# Altium project Milestone1.PrjPcb
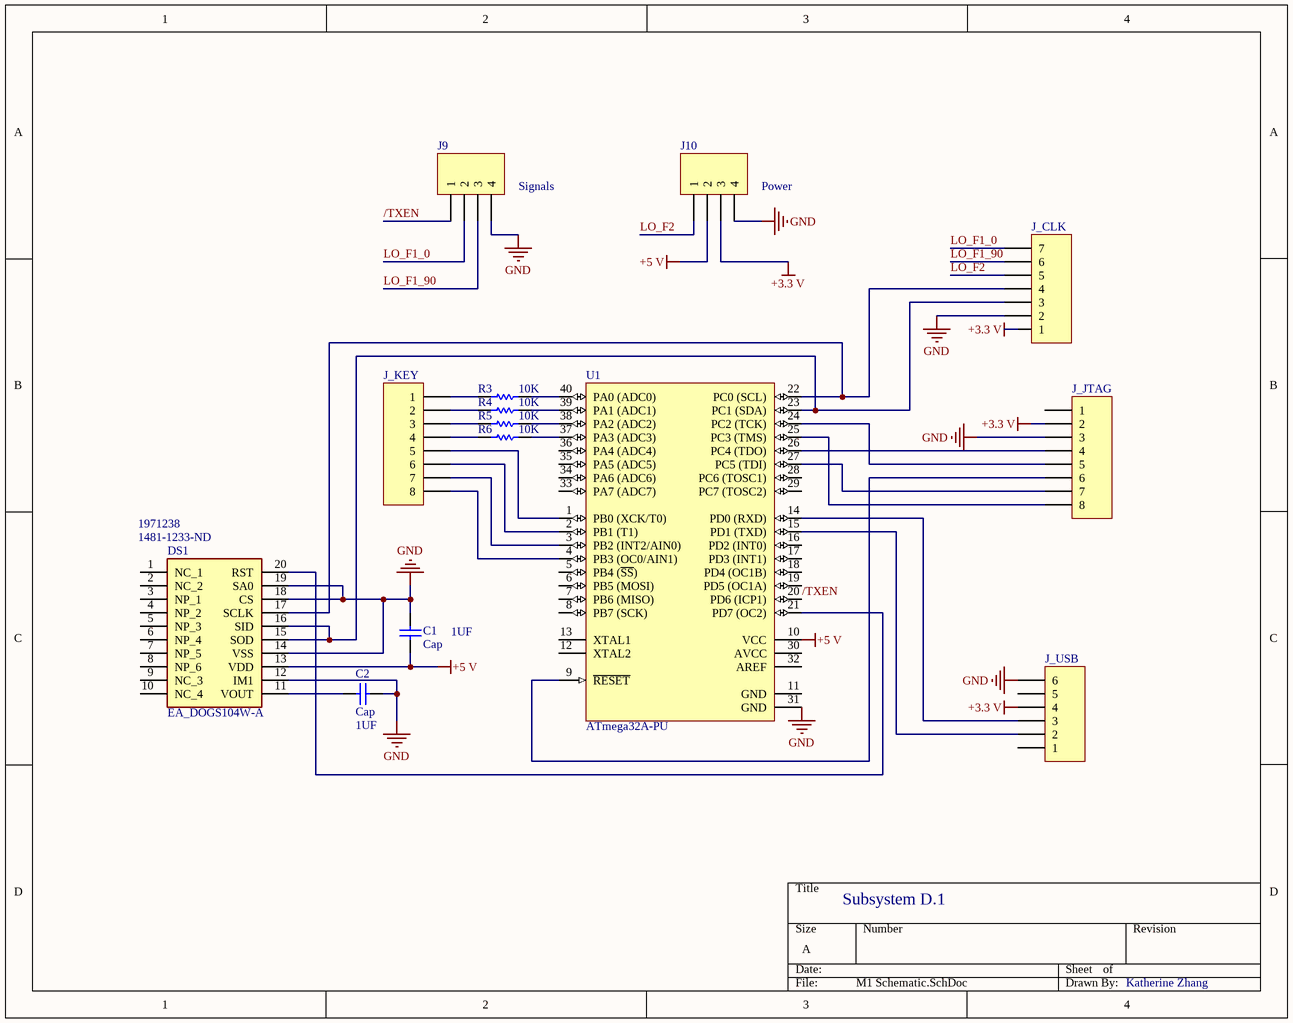
[diagram p0: M1 Schematic.SchDoc]
2 sheets, 22 parts. Net scope: global (net labels, ports and power ports of the same name join across sheets).
Board files: M2 PCB.PcbDoc, M2 PCB TX-RX.PcbDoc
Sheets:
  M1 Schematic.SchDoc
  M1 Schematic 2.SchDoc

## Sheet M1 Schematic.SchDoc: M1 Schematic
size A; Date: 2/22/2022; DrawnBy: Katherine Zhang; Revision: 1.0; SheetNumber: 1; SheetTotal: 2

### Parts
C1  Cap  value 1UF  [RADIAL-0.1]
C2  Cap  value 1UF  [RADIAL-0.1]
DS1  EA_DOGS104W-A  Supplier Part Number 1: 1481-1233-ND  Supplier Part Number 2: 1971238  [DIP2540W50P254L3600H260Q20N]
J9  Signals  [HDR1X4]
J10  Power  [HDR1X4]
J_CLK  Header 7  [HDR1X7]  (value not drawn)
J_JTAG  Header 8  [HDR1X8]  (value not drawn)
J_KEY  Header 8  [HDR1X8]  (value not drawn)
J_USB  Header 6  [HDR1X6]  (value not drawn)
R3  value 10K  [AXIAL-0.1-RES]  (hidden comment: Res1)
R4  value 10K  [AXIAL-0.1-RES]  (hidden comment: Res1)
R5  value 10K  [AXIAL-0.1-RES]  (hidden comment: Res1)
R6  value 10K  [AXIAL-0.1-RES]  (hidden comment: Res1)
U1  ATmega32A-PU  [40P6]

### Nets
+3.3 V: J10.3 J_CLK.1 J_JTAG.2 J_USB.4
+5 V: C1.1 DS1.13(VDD) J10.2 U1.10(VCC)
GND: C1.2 C2.2 DS1.12(IM1) DS1.14(VSS) DS1.18(CS) DS1.19(SA0) J9.4 J10.4 J_CLK.2 J_JTAG.3 J_USB.6 U1.31(GND)
/TXEN: J9.1 U1.20(PD6_(ICP1))
LO_F1_0: J9.2 J_CLK.7
LO_F1_90: J9.3 J_CLK.6
LO_F2: J10.1 J_CLK.5
NetC2_1: C2.1 DS1.11(VOUT)
NetDS1_15: DS1.15(SOD) DS1.16(SID) J_CLK.3 U1.23(PC1_(SDA))
NetDS1_17: DS1.17(SCLK) J_CLK.4 U1.22(PC0_(SCL))
NetDS1_20: DS1.20(RST) U1.21(PD7_(OC2))
NetJ_JTAG_4: J_JTAG.4 U1.26(PC4_(TDO))
NetJ_JTAG_5: J_JTAG.5 U1.24(PC2_(TCK))
NetJ_JTAG_6: J_JTAG.6 U1.9(~{RESET})
NetJ_JTAG_7: J_JTAG.7 U1.27(PC5_(TDI))
NetJ_JTAG_8: J_JTAG.8 U1.25(PC3_(TMS))
NetJ_KEY_1: J_KEY.1 R3.1
NetJ_KEY_2: J_KEY.2 R4.1
NetJ_KEY_3: J_KEY.3 R5.1
NetJ_KEY_4: J_KEY.4 R6.1
NetJ_KEY_5: J_KEY.5 U1.1(PB0_(XCK/T0))
NetJ_KEY_6: J_KEY.6 U1.2(PB1_(T1))
NetJ_KEY_7: J_KEY.7 U1.3(PB2_(INT2/AIN0))
NetJ_KEY_8: J_KEY.8 U1.4(PB3_(OC0/AIN1))
NetJ_USB_2: J_USB.2 U1.15(PD1_(TXD))
NetJ_USB_3: J_USB.3 U1.14(PD0_(RXD))
NetR3_2: R3.2 U1.40(PA0_(ADC0))
NetR4_2: R4.2 U1.39(PA1_(ADC1))
NetR5_2: R5.2 U1.38(PA2_(ADC2))
NetR6_2: R6.2 U1.37(PA3_(ADC3))

Not connected (* = marked no-connect by the designer): DS1 1(NC_1) 2(NC_2) 3(NP_1) 4(NP_2) 5(NP_3) 6(NP_4) 7(NP_5) 8(NP_6) 9(NC_3) 10(NC_4); J_JTAG 1; J_USB 1 5; U1 5(PB4_(~{SS})) 6(PB5_(MOSI)) 7(PB6_(MISO)) 8(PB7_(SCK)) 11(GND) 12(XTAL2) 13(XTAL1) 16(PD2_(INT0)) 17(PD3_(INT1)) 18(PD4_(OC1B)) 19(PD5_(OC1A)) 28(PC6_(TOSC1)) 29(PC7_(TOSC2)) 30(AVCC) 32(AREF) 33(PA7_(ADC7)) 34(PA6_(ADC6)) 35(PA5_(ADC5)) 36(PA4_(ADC4))

### Notes on the sheet
- Subsystem D.1
- Katherine Zhang

### Library data of the parts
C1 C2 = CAP ALUM 1UF 20% 100V RADIAL: Capacitor; Manufacturer Part Number: ESE105M100AC3EA; Designator: C?; Voltage Rating: 100V; Published: 8-Jun-2000; LatestRevisionDate: 17-Jul-2002; LatestRevisionNote: Re-released for DXP Platform.; Publisher: Altium Limited
DS1 = EA_DOGS104W-A: LCM char. 4x10 FSTN White; Manufacturer_Name: ELECTRONIC ASSEMBLY; Manufacturer_Part_Number: EA DOGS104W-A; Manufacturer: Display Visions; Manufacturer Part Number: EADOGS104W-A; Interface: I2C,SPI; Number of Characters: 40; Backlight Type: LED; Datasheet Link: https://componentsearchengine.com//EA DOGS104W-A.pdf; Height: 2.6mm; Mouser2 Part Number: 790-EADOGS104W-A; Mouser2 Price/Stock: https://www.mouser.com/Search/Refine.aspx?Keyword=790-EADOGS104W-A; Supplier 1: Digi-Key; RoHS: No; Stock 1: 221; Pricing 1: 1=18.94000, 10=14.28400, 100=11.99810, 500=11.55000 (USD); Min Operating Temperature: -20°C; Max Operating Temperature: 70°C; Background Color: White; ComponentLink1URL: http://www.lcd-module.de/fileadmin/html-seiten/eng/pdf/doma/dogs104e.pdf?src-supplier=Digi-Key; ComponentLink1Description: http://www.lcd-module.de/fileadmin/html-seiten/eng/pdf/doma/dogs104e.pdf?src-supplier=Digi-Key; Supplier 2: RSComponents; Stock 2: 5; Pricing 2: 1=15.55000, 5=14.06000, 10=13.29000, 25=12.60000 (GBP); ComponentLink2URL: http://www.mouser.com/ds/2/127/dogs104e-553061.pdf?src-supplier=Mouser; ComponentLink2Description: http://www.mouser.com/ds/2/127/dogs104e-553061.pdf?src-supplier=Mouser
J9 J10 = Header 4: Conn Header Vert 4POS 2.54MM; Manufacturer: Sullins; Manufacturer Part Number: PRPC004SAAN-RC; Number of Positions: 4; Connector Type: Male Pin; Pitch: 0.1inch; LatestRevisionDate: 17-Jul-2002; LatestRevisionNote: Re-released for DXP Platform.; Publisher: Altium Limited; Supplier 1: Digi-Key; Supplier Part Number 1: S1011EC-04-ND; RoHS: Yes; Category: Connectors; Stock 1: 11461; Pricing 1: 1=0.15000, 10=0.14600, 25=0.10840, 50=0.09280, 100=0.08980, 250=0.07740, 500=0.07430 (USD); Mount: Through Hole; Color: Black; Contact Plating: Gold; Package Quantity: 1; Number of Rows: 1; Packaging: Bulk; Termination: Solder; Series: -; Contact Type: Male Pin; Contact Mating Length: 0.23inch; RoHS Compliant: Yes; ComponentLink1URL: https://datasheet.ciiva.com/741/xrxczzzsxxn-rc-st-11635-b-741241.pdf?src-supplier=Digi-Key; ComponentLink1Description: https://datasheet.ciiva.com/741/xrxczzzsxxn-rc-st-11635-b-741241.pdf?src-supplier=Digi-Key
J_CLK = Header 7: Female, 7C, Straight, .100"CC; 3.20mm Tail, No Mt. 100u" Tin; PBT, Phos Bronze, 105 C; Manufacturer: Sullins; Manufacturer Part Number: PPTC071LFBN-RC; Number of Positions: 7; Pitch: 0.1inch; LatestRevisionDate: 17-Jul-2002; LatestRevisionNote: Re-released for DXP Platform.; Publisher: Altium Limited; Supplier 1: Digi-Key; Supplier Part Number 1: S7005-ND; RoHS: Yes; Category: Connectors; Stock 1: 25873; Pricing 1: 1=0.59000, 10=0.51500, 80=0.42438, 440=0.36900, 1000=0.30442, 5000=0.26752, 10000=0.26650 (USD); Mount: Through Hole; Color: Black; Contact Plating: Tin; Contact Material: Bronze; Housing Material: Plastic; Package Quantity: 1000; Number of Rows: 1; Packaging: Bulk; Termination: Solder; Connector Type: Header; Contact Type: Female Socket; Length: 18.3mm; Width: 2.5mm; Height: 8.5mm; Lead Free: Lead Free; ComponentLink1URL: https://media.digikey.com/pdf/Data%20Sheets/Sullins%20PDFs/Female_Headers.100_DS.pdf?src-supplier=Digi-Key; ComponentLink1Description: https://media.digikey.com/pdf/Data%20Sheets/Sullins%20PDFs/Female_Headers.100_DS.pdf?src-supplier=Digi-Key; ComponentLink2URL: http://www.sullinscorp.com/catalogs/78_Page80-81_HEADER_.100_2.54mm_FEMALE.pdf?src-supplier=Future+Electronics; ComponentLink2Description: http://www.sullinscorp.com/catalogs/78_Page80-81_HEADER_.100_2.54mm_FEMALE.pdf?src-supplier=Future+Electronics
J_JTAG J_KEY = Header 8: Conn Header Vert 8POS 2.54MM; Manufacturer: Sullins; Manufacturer Part Number: PRPC008SAAN-RC; Number of Positions: 8; Connector Type: Male Pin; Pitch: 0.1inch; LatestRevisionDate: 17-Jul-2002; LatestRevisionNote: Re-released for DXP Platform.; Publisher: Altium Limited; Supplier 1: Digi-Key; Supplier Part Number 1: S1011EC-08-ND; RoHS: Yes; Category: Connectors; Stock 1: 4930; Pricing 1: 1=0.25000, 10=0.23200, 25=0.19800, 50=0.17340, 100=0.16100, 250=0.14240, 500=0.13622 (USD); Mount: Through Hole; Color: Black; Contact Plating: Gold; Package Quantity: 1; Number of Rows: 1; Packaging: Bulk; Termination: Solder; Series: -; Contact Type: Male Pin; Contact Mating Length: 0.23inch; Lead Free: Lead Free; RoHS Compliant: Yes; ComponentLink1URL: https://datasheet.ciiva.com/741/xrxczzzsxxn-rc-st-11635-b-741237.pdf?src-supplier=Digi-Key; ComponentLink1Description: https://datasheet.ciiva.com/741/xrxczzzsxxn-rc-st-11635-b-741237.pdf?src-supplier=Digi-Key
J_USB = Header 6: Conn Header .100" Sngl Str 6POS; Manufacturer: Sullins; Manufacturer Part Number: PRPC006SAAN-RC; Number of Positions: 6; Connector Type: Male Pin; Pitch: 0.1inch; LatestRevisionDate: 17-Jul-2002; LatestRevisionNote: Re-released for DXP Platform.; Publisher: Altium Limited; Supplier 1: Digi-Key; Supplier Part Number 1: S1011EC-06-ND; RoHS: Yes; Category: Connectors; Stock 1: 13258; Pricing 1: 1=0.19000, 10=0.17400, 25=0.14880, 50=0.13000, 100=0.12070, 250=0.10680, 500=0.10216 (USD); Mount: Through Hole; Color: Black; Contact Plating: Gold; Package Quantity: 1; Number of Rows: 1; Packaging: Bulk; Termination: Solder; Series: -; Contact Type: Male Pin; Contact Mating Length: 0.23inch; Lead Free: Lead Free; RoHS Compliant: Yes; ComponentLink1URL: https://datasheet.ciiva.com/741/xrxczzzsxxn-rc-st-11635-b-741239.pdf?src-supplier=Digi-Key; ComponentLink1Description: https://datasheet.ciiva.com/741/xrxczzzsxxn-rc-st-11635-b-741239.pdf?src-supplier=Digi-Key
R3-R6 = RES 10K OHM 5% 1/4W AXIAL: Resistor; Manufacturer Part Number: CFR-25JB-52-10K; Designator: R?; Power Rating: 1/4W; Tolerance: 0.05; Published: 8-Jun-2000; LatestRevisionDate: 17-Jul-2002; LatestRevisionNote: Re-released for DXP Platform.; Publisher: Altium Limited
U1 = CMP-0095-00028-2: 8-bit AVR Microcontroller, 2.7-5.5V, 16MHz, 32KB Flash, 1KB EEPROM, 2KB SRAM, 40-pin PDIP, Industrial Grade (-40°C to 85°C); Manufacturer: Microchip; Manufacturer Part Number: ATMEGA324A-PU; Interface: I2C,SPI,UART,USART; Peripherals: Brown-out Detect/Reset,POR,PWM,WDT; Frequency: 20MHz; Number of I/Os: 32; Oscillator Type: Internal; Code_JEDEC: MS-011-AC; ComponentLink3Description: ATmega32A Summary; PackageVersion: revB, Sep-2001; ComponentLink2Description: ATmega32A Datasheet; ComponentLink3URL: http://www.atmel.com/dyn/resources/prod_documents/8155S.pdf; PackageDescription: 40-lead (0.600"/15.24mm Wide) Plastic Dual Inline Package (PDIP); ComponentLink1Description: Manufacturer URL; PackageReference: 40P6; DatasheetVersion: revC, Feb-2011; ComponentLink2URL: http://www.atmel.com/dyn/resources/prod_documents/doc8155.pdf; RevisionNote: DatasheetVersion updated. URLs added.; ComponentLink1URL: http://www.atmel.com/; Supplier 1: Digi-Key; Supplier Part Number 1: ATMEGA324A-PU-ND; RoHS: Yes; Category: Microcontrollers; Stock 1: 315; Pricing 1: 1=4.77000, 25=4.38160, 100=3.97500 (USD); Case/Package: DIP; Min Operating Temperature: -40°C; Max Operating Temperature: 85°C; Core Architecture: AVR; Memory Type: FLASH; Packaging: Rail/Tube; Memory Size: 32KB; RoHS Compliant: Yes; ComponentLink4URL: http://ww1.microchip.com/downloads/en/devicedoc/Atmel-8272-8-bit-AVR-microcontroller-ATmega164A_PA-324A_PA-644A_PA-1284_P_summary.pdf?src-supplier=Digi-Key; ComponentLink4Description: http://ww1.microchip.com/downloads/en/devicedoc/Atmel-8272-8-bit-AVR-microcontroller-ATmega164A_PA-324A_PA-644A_PA-1284_P_summary.pdf?src-supplier=Digi-Key

## Sheet M1 Schematic 2.SchDoc: TX/RX Switch
size A; Date: Feb 27 2022; DrawnBy: Katherine Zhang; SheetNumber: 2; SheetTotal: 2
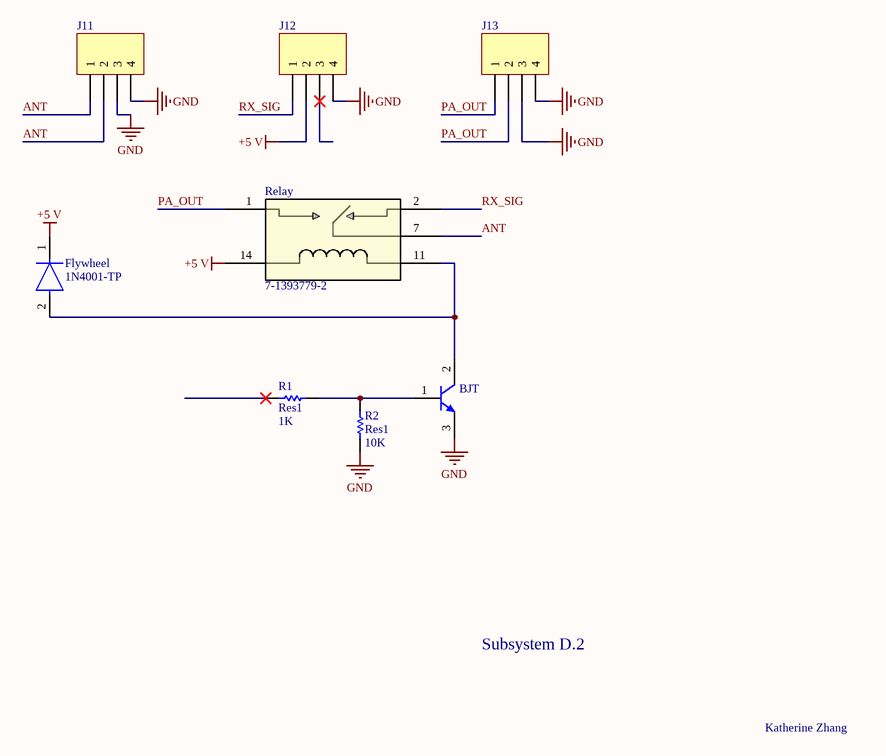
[diagram p1: M1 Schematic 2.SchDoc]

### Parts
BJT  2N2222A  [STM-TO-18-3]  (value not drawn)
Flywheel  1N4001-TP  [FP-DO-41-MFG]
J11  Header 4  [HDR1X4]  (value not drawn)
J12  Header 4  [HDR1X4]  (value not drawn)
J13  Header 4  [HDR1X4]  (value not drawn)
R1  Res1  value 1K  [AXIAL-0.1-RES]
R2  Res1  value 10K  [AXIAL-0.1-RES]
Relay  7-1393779-2  [RELAY_7-1393779-2]

### Nets
+5 V: Flywheel.1(C) J12.2 Relay.14
GND: BJT.3(E) J11.3 J11.4 J12.4 J13.3 J13.4 R2.1
ANT: J11.1 J11.2 Relay.7
PA_OUT: J13.1 J13.2 Relay.1
RX_SIG: J12.1 Relay.2
NetBJT_1: BJT.1(B) R1.2 R2.2
NetBJT_2: BJT.2(C) Flywheel.2(A) Relay.11

Not connected (* = marked no-connect by the designer): J12 3*; R1 1*

### Notes on the sheet
- Subsystem D.2
- Katherine Zhang

### Library data of the parts
BJT = CMP-2000-05381-1: High Speed Switch, 0.6 A IC, -65 to 175 degC, 3-Pin TO-18, RoHS, Bulk; Manufacturer: STMicroelectronics; Power Dissipation Pd: 500mW; DC Current Gain hFE: 300hFE; Transistor Polarity: NPN; DC Collector Current: 600mA; No. of Pins: 3Pins; Transition Frequency ft: 300MHz; Collector Emitter Voltage V(br)ceo: 40V; hFE Min: 40; Max Power Dissipation: 400mW; Number of Elements: 1; Collector Base Voltage (VCBO): 75V; Emitter Base Voltage (VEBO): 6V; Collector Emitter Saturation Voltage: 1V; Element Configuration: Single; Product Range: -; Package Reference: TO-18-3; Datasheet URL: https://datasheet.ciiva.com/25917/cd00003223-25917094.pdf; Automotive Qualification Standard: -; Transistor Case Style: TO-18; Operating Temperature Max: 175degC; Datasheet Version: Feb-03; Package Description: 3-Pin Through Hole Device, Dia 5.8 mm, Pitch 1.27 mm; Manufacturer URL: http://www.st.com/; Supplier 1: Digi-Key; Supplier Part Number 1: 497-2598-ND; Manufacturer Part Number: 2N2222A; RoHS: Yes; Category: BJTs; Mount: Through Hole; Case/Package: TO-18-3; Number of Pins: 3; Weight: 0.012346oz; Min Operating Temperature: -65°C; Max Operating Temperature: 175°C; Frequency: 300MHz; Packaging: Bulk; Package Quantity: 1000; Collector Emitter Voltage (VCEO): 40V; Polarity: NPN; Max Collector Current: 600mA; Collector Emitter Breakdown Voltage: 40V; Transition Frequency: 300MHz; Power Dissipation: 500mW; Max Frequency: 300MHz; Gain Bandwidth Product: 300MHz; Voltage Rating (DC): 75V; Current Rating: 600mA; Type: Switch; Collector-emitter Voltage-Max: 40V; Series: 2N2222; Continuous Collector Current: 600mA; Length: 5.8mm; Width: 5.8mm; Height: 1.5mm; Radiation Hardening: No; REACH SVHC: No SVHC; Lead Free: Contains Lead; RoHS Compliant: Yes; ComponentLink1URL: https://datasheet.ciiva.com/25917/cd00003223-25917094.pdf?src-supplier=Avnet+Europe; ComponentLink1Description: https://datasheet.ciiva.com/25917/cd00003223-25917094.pdf?src-supplier=Avnet+Europe; ComponentLink2URL: https://datasheet.ciiva.com/15192/getdatasheetpartid-292165-15192875.pdf?src-supplier=Verical; ComponentLink2Description: https://datasheet.ciiva.com/15192/getdatasheetpartid-292165-15192875.pdf?src-supplier=Verical; ComponentLink3URL: https://datasheet.ciiva.com/14166/2n2222a-eng-tds-14166093.pdf?src-supplier=Distrelec; ComponentLink3Description: https://datasheet.ciiva.com/14166/2n2222a-eng-tds-14166093.pdf?src-supplier=Distrelec; ComponentLink4URL: https://datasheet.ciiva.com/16427/cd00003223-16427384.pdf?src-supplier=Future+Electronics; ComponentLink4Description: https://datasheet.ciiva.com/16427/cd00003223-16427384.pdf?src-supplier=Future+Electronics; ComponentLink5URL: https://datasheet.ciiva.com/977/cd00003223-977271.pdf?src-supplier=Digi-Key; ComponentLink5Description: https://datasheet.ciiva.com/977/cd00003223-977271.pdf?src-supplier=Digi-Key; ComponentLink6URL: https://datasheet.ciiva.com/1194/1449532-1194083.pdf?src-supplier=Element14; ComponentLink6Description: https://datasheet.ciiva.com/1194/1449532-1194083.pdf?src-supplier=Element14; ComponentLink7URL: https://datasheet.ciiva.com/29323/163147-da-01-en-transistor-2-n-2222-a-to18-stm-29323030.pdf?src-supplier=Conrad; ComponentLink7Description: https://datasheet.ciiva.com/29323/163147-da-01-en-transistor-2-n-2222-a-to18-stm-29323030.pdf?src-supplier=Conrad
Flywheel = CMP-56207-000001-1: DIODE GEN PURP 50V 1A DO41; Manufacturer: Micro Commercial; Max Surge Forward Current: 30A; Max Junction Temp: +150°C; Capacitance: 15pF; Peak Reverse Current: 5uA; Value: 15pF; Forward Voltage: 1.1V; Recovery Time: 2000ns; Reverse Recovery Time: 2us; Element Configuration: Single; Polarity: Standard; Manufacturer Part Number: 1N4001-TP; Height: 2.7mm; Device Class L3: Rectifier Diodes; Octopart: https://octopart.com/1n4001-tp-mcc-730241; ComponentLink2URL: http://www.mccsemi.com/up_pdf/1N4001-1N4007(DO-41).pdf; ComponentLink2Description: Datasheet; Reverse Voltage: 50V; Lead Free: Yes; Temperature: -55°C to +150°C; Forward Current: 1A; RoHS: TRUE; Temperature Range Low: -55°C; Package: DO-41; Category: Diode; Temperature Range High: +150°C; Digikey Description: DIODE GEN PURP 50V 1A DO41; Ipc Land Pattern Name: DIOPA1114W105L520D270; Mouser Description: Rectifiers Vr/50V Io/1A; Max Repetitive Reverse Voltage: 50V; Device Class L1: Discrete Semiconductors; Automotive: No; Device Class L2: Diodes; Supplier 1: Digi-Key; Supplier Part Number 1: 1N4001-TPMSTR-ND; Pricing 1: 5000=0.03520, 10000=0.02992, 25000=0.02816, 50000=0.02640, 125000=0.02400 (USD); Mount: Through Hole; Case/Package: DO-41; Number of Pins: 2; Min Operating Temperature: -55°C; Max Operating Temperature: 150°C; Max Surge Current: 30A; Package Quantity: 5000; Packaging: Tape and Reel; Max Reverse Current: 5uA; Average Rectified Current: 1A; Max Forward Surge Current (Ifsm): 30A; Max Repetitive Reverse Voltage (Vrrm): 50V; Peak Non-Repetitive Surge Current: 30A; Voltage Rating (DC): 50V; Current Rating: 1A; Output Current: 1A; Max Reverse Voltage (DC): 50V; Diameter: 2.7mm; Length: 5.2mm; Radiation Hardening: No; REACH SVHC: Unknown; RoHS Compliant: Yes; ComponentLink1URL: https://datasheet.ciiva.com/7624/1684824-7624692.pdf?src-supplier=Element14; ComponentLink1Description: https://datasheet.ciiva.com/7624/1684824-7624692.pdf?src-supplier=Element14; ComponentLink3URL: https://datasheet.ciiva.com/911/1n4001-1n4007do-41-911653.pdf?src-supplier=Digi-Key; ComponentLink3Description: https://datasheet.ciiva.com/911/1n4001-1n4007do-41-911653.pdf?src-supplier=Digi-Key; ComponentLink4URL: https://datasheet.ciiva.com/911/1n4001-1n4007do-41-911654.pdf?src-supplier=Digi-Key; ComponentLink4Description: https://datasheet.ciiva.com/911/1n4001-1n4007do-41-911654.pdf?src-supplier=Digi-Key; ComponentLink5URL: https://datasheet.ciiva.com/14557/70055511-14557706.pdf?src-supplier=Allied+Electronics; ComponentLink5Description: https://datasheet.ciiva.com/14557/70055511-14557706.pdf?src-supplier=Allied+Electronics; ComponentLink6URL: https://datasheet.ciiva.com/16747/1n4001-1n4007do-41-16747013.pdf?src-supplier=Future+Electronics; ComponentLink6Description: https://datasheet.ciiva.com/16747/1n4001-1n4007do-41-16747013.pdf?src-supplier=Future+Electronics; ComponentLink7URL: https://datasheet.ciiva.com/28381/1684824-28381848.pdf?src-supplier=Element14; ComponentLink7Description: https://datasheet.ciiva.com/28381/1684824-28381848.pdf?src-supplier=Element14
J11-J13 = Header 4: as J9 on sheet M1 Schematic; LatestRevisionDate: 17-Jul-2002; LatestRevisionNote: Re-released for DXP Platform.; Publisher: Altium Limited; Supplier 1: Digi-Key; Supplier Part Number 1: S1011EC-04-ND; RoHS: Yes; Category: Connectors; Stock 1: 11461; Pricing 1: 1=0.15000, 10=0.14600, 25=0.10840, 50=0.09280, 100=0.08980, 250=0.07740, 500=0.07430 (USD); Mount: Through Hole; Color: Black; Contact Plating: Gold; Package Quantity: 1; Number of Rows: 1; Packaging: Bulk; Termination: Solder; Series: -; Contact Type: Male Pin; Contact Mating Length: 0.23inch; RoHS Compliant: Yes; ComponentLink1URL: https://datasheet.ciiva.com/741/xrxczzzsxxn-rc-st-11635-b-741241.pdf?src-supplier=Digi-Key; ComponentLink1Description: https://datasheet.ciiva.com/741/xrxczzzsxxn-rc-st-11635-b-741241.pdf?src-supplier=Digi-Key
R1 = RES 1K OHM 5% 1/4W AXIAL: Resistor; Manufacturer Part Number: CFR-25JB-52-1K; Designator: R?; Power Rating: 1/4W; Tolerance: 0.05; Published: 8-Jun-2000; LatestRevisionDate: 17-Jul-2002; LatestRevisionNote: Re-released for DXP Platform.; Publisher: Altium Limited
R2 = RES 10K OHM 5% 1/4W AXIAL: as R3 on sheet M1 Schematic; Published: 8-Jun-2000; LatestRevisionDate: 17-Jul-2002; LatestRevisionNote: Re-released for DXP Platform.; Publisher: Altium Limited
Relay = 7-1393779-2: No Description Available; Mfr_Name: TE Connectivity; Copyright: Copyright (C) 2022 Ultra Librarian. All rights reserved.; Manufacturer_Part_Number: 7-1393779-2; RefDes: RefDes; Type: DEV

## Nets that join several sheets
+5 V: M1 Schematic (C1.1 DS1.13 J10.2 U1.10), M1 Schematic 2 (Flywheel.1 J12.2 Relay.14)
GND: M1 Schematic (12 pins), M1 Schematic 2 (7 pins)